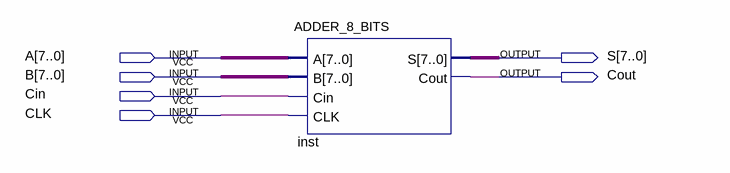
[diagram p0: schematic sheet]
// Quartus schematic tmp.bdf as structural Verilog: 1 symbols, 6 pins
module tmp (
  input  [7:0] A,
  input  [7:0] B,
  input  Cin,
  input  CLK,
  output [7:0] S,
  output Cout
);

  ADDER_8_BITS inst (.A(A), .B(B), .Cin(Cin), .CLK(CLK), .S(S), .Cout(Cout));
endmodule
